# Altium schematic sheet ENCODER.SchDoc
size 330 x 220 mm; SheetNumber: 1; SheetTotal: 1
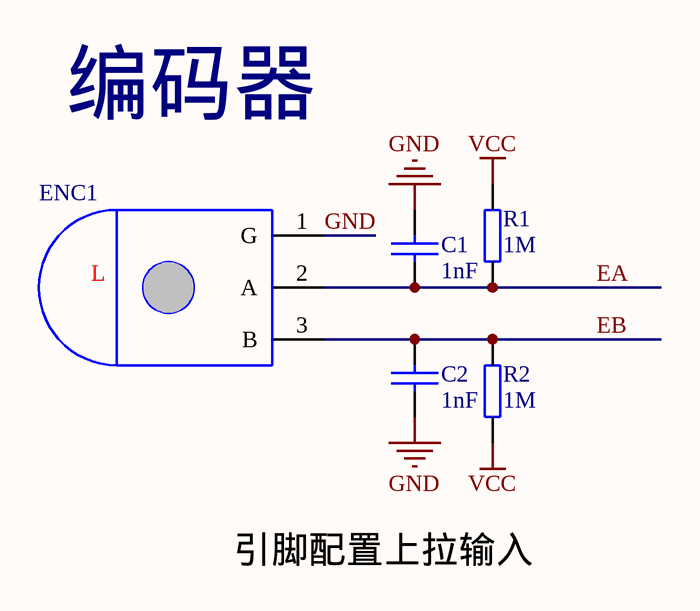
[diagram p0: ENCODER.SchDoc]

## Parts
C1  1nF  [0402_C]
C2  1nF  [0402_C]
ENC1  (no value)  [ENC-11-2]
R1  1M  [0402]
R2  1M  [0402]

## Nets
GND: C1.1 C2.1 ENC1.1(G)
VCC: R1.1 R2.2
EA: C1.2 ENC1.2(A) R1.2
EB: C2.2 ENC1.3(B) R2.1

## Notes on the sheet
- 编码器
- 引脚配置上拉输入
- (in symbol ENC) L

## Library data of the parts
C1 C2 = CAP: Capacitor
ENC1 = ENC
R1 R2 = RES